# Altium schematic sheet 5V_Power_Stage.SchDoc (part 3 of 3)
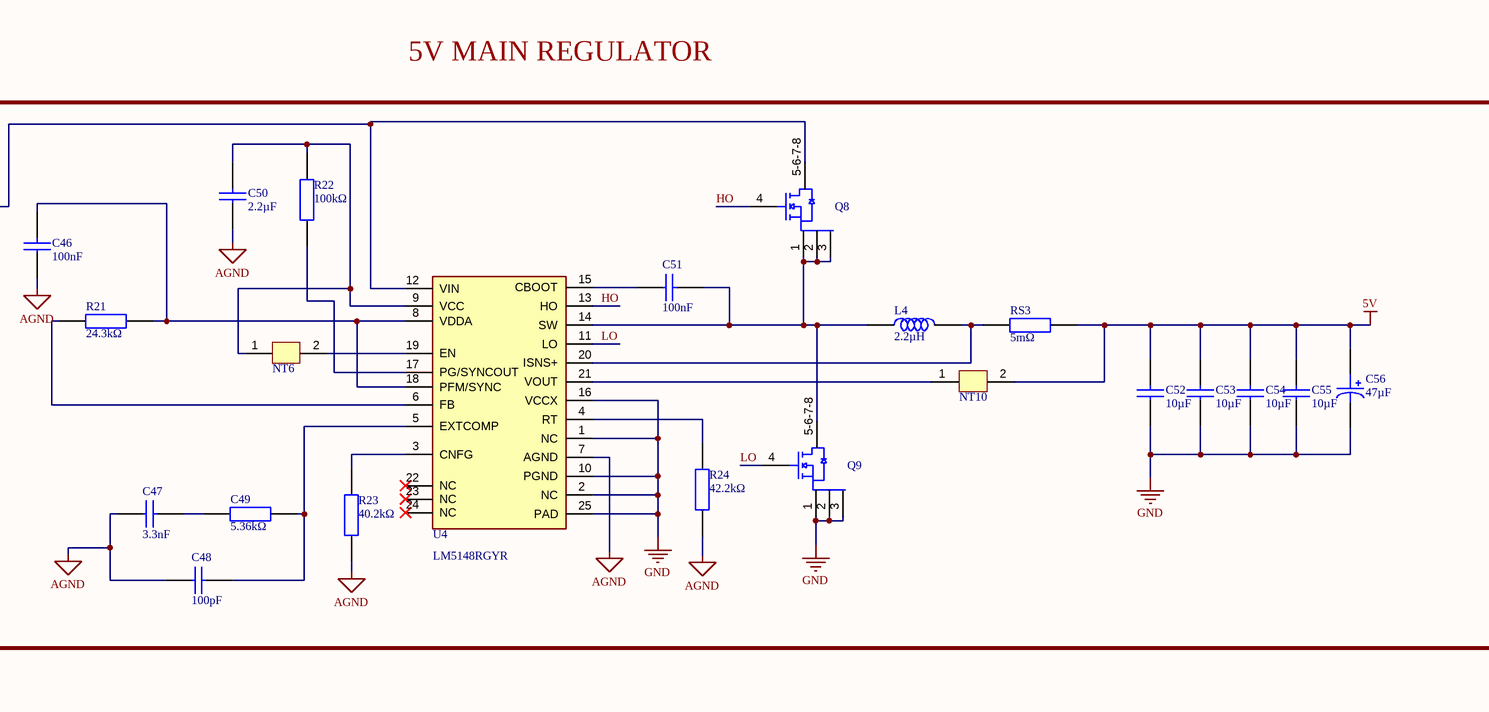
[diagram p3: 5V_Power_Stage.SchDoc, right]

## Library data of the parts (continued)
R21 = CRCW040224K3FKED: Fixed Resistor, Metal Glaze/Thick Film, 0.063W, 24300ohm, 50V, 1% +/-Tol, Surface Mount, 0402; Manufacturer: Vishay; Max Power Dissipation: 63mW; Temperature Coefficient: 100ppm/°C; Supplier: Farnell; Supplier Part Number: CRCW040224K3FKED; Manufacturer Part Number: CRCW040224K3FKED; RoHS: Compliant; Category: Chip SMD Resistors; Stock: 10000; Pricing: 10000=0,009 (EUR); Case/Package: 0402; Case Code (Imperial): 0402; China RoHS: Non-Compliant; Composition: Thick Film; Contact Plating: Tin; Country of Origin: Israel, Taiwan; Depth: 500µm; Export Control Classification Number (ECCN) Code: EAR99; Features: Automotive AEC-Q200; Height: 350µm; Harmonized Tariff Schedule (HTS) Code: 8533.21.00.30; Introduction Date: 2005-03-24; Lead Free: Lead Free; Length: 1mm; Lifecycle Status: Production; Max Operating Temperature: 155°C; Military Standard: Not; Min Operating Temperature: -55°C; Mounting Technology: Surface Mount; Pins: 2; Number of Terminals: 2; Number of Terminations: 2; Packaging: Cut Tape; Power Rating: 63mW; Radiation Hardening: No; Ratings: AEC-Q200; REACH SVHC: Yes; Schedule B: 8533210045; Termination: SMD/SMT; Tolerance: 1%; Voltage Rating: 50V; Voltage Rating (DC): 50V; Weight: 652.039032µg; Width: 500µm; Working Voltage: 50V; ComponentLink1URL: https://datasheet.octopart.com:443/CRCW040224K3FKED-Vishay-datasheet-175423584.pdf?src-supplier=IHS; ComponentLink1Description: https://datasheet.octopart.com:443/CRCW040224K3FKED-Vishay-datasheet-175423584.pdf?src-supplier=IHS; ComponentLink2URL: https://datasheet.octopart.com:443/CRCW040224K3FKED-Vishay-datasheet-66077789.pdf?src-supplier=Newark; ComponentLink2Description: https://datasheet.octopart.com:443/CRCW040224K3FKED-Vishay-datasheet-66077789.pdf?src-supplier=Newark; ComponentLink3URL: https://datasheet.octopart.com:443/CRCW040224K3FKED-Vishay-datasheet-11761042.pdf?src-supplier=Newark; ComponentLink3Description: https://datasheet.octopart.com:443/CRCW040224K3FKED-Vishay-datasheet-11761042.pdf?src-supplier=Newark; ComponentLink4URL: https://datasheet.octopart.com:443/CRCW040224K3FKED-Vishay-datasheet-11516975.pdf?src-supplier=Newark; ComponentLink4Description: https://datasheet.octopart.com:443/CRCW040224K3FKED-Vishay-datasheet-11516975.pdf?src-supplier=Newark; ComponentLink5URL: https://datasheet.octopart.com:443/CRCW040224K3FKED-Vishay-datasheet-41302739.pdf?src-supplier=Newark; ComponentLink5Description: https://datasheet.octopart.com:443/CRCW040224K3FKED-Vishay-datasheet-41302739.pdf?src-supplier=Newark; ComponentLink6URL: https://datasheet.octopart.com:443/CRCW040224K3FKED-Vishay-datasheet-33013972.pdf?src-supplier=Newark; ComponentLink6Description: https://datasheet.octopart.com:443/CRCW040224K3FKED-Vishay-datasheet-33013972.pdf?src-supplier=Newark; ComponentLink7URL: https://datasheet.octopart.com:443/CRCW040224K3FKED-Vishay-datasheet-21226360.pdf?src-supplier=Newark; ComponentLink7Description: https://datasheet.octopart.com:443/CRCW040224K3FKED-Vishay-datasheet-21226360.pdf?src-supplier=Newark; ComponentLink8URL: https://datasheet.octopart.com:443/CRCW040224K3FKED-Vishay-datasheet-62317933.pdf?src-supplier=Farnell; ComponentLink8Description: https://datasheet.octopart.com:443/CRCW040224K3FKED-Vishay-datasheet-62317933.pdf?src-supplier=Farnell; ComponentLink9URL: https://datasheet.octopart.com:443/CRCW040224K3FKED.-Vishay-datasheet-83961561.pdf?src-supplier=Farnell; ComponentLink9Description: https://datasheet.octopart.com:443/CRCW040224K3FKED.-Vishay-datasheet-83961561.pdf?src-supplier=Farnell; ComponentLink10URL: https://datasheet.octopart.com:443/CRCW040224K3FKED-Vishay-datasheet-14722531.pdf?src-supplier=element14+APAC; ComponentLink10Description: https://datasheet.octopart.com:443/CRCW040224K3FKED-Vishay-datasheet-14722531.pdf?src-supplier=element14+APAC; ComponentLink11URL: https://datasheet.octopart.com:443/CRCW040224K3FKED-Vishay-datasheet-5299586.pdf?src-supplier=element14+APAC; ComponentLink11Description: https://datasheet.octopart.com:443/CRCW040224K3FKED-Vishay-datasheet-5299586.pdf?src-supplier=element14+APAC; ComponentLink12URL: https://datasheet.octopart.com:443/CRCW040224K3FKED-Vishay-datasheet-10380026.pdf?src-supplier=element14+APAC; ComponentLink12Description: https://datasheet.octopart.com:443/CRCW040224K3FKED-Vishay-datasheet-10380026.pdf?src-supplier=element14+APAC; ComponentLink13URL: https://datasheet.octopart.com:443/CRCW040224K3FKED-Vishay-datasheet-62316122.pdf?src-supplier=Future+Electronics; ComponentLink13Description: https://datasheet.octopart.com:443/CRCW040224K3FKED-Vishay-datasheet-62316122.pdf?src-supplier=Future+Electronics; ComponentLink14URL: https://datasheet.octopart.com:443/CRCW040224K3FKED-Vishay-datasheet-12509741.pdf?src-supplier=Future+Electronics; ComponentLink14Description: https://datasheet.octopart.com:443/CRCW040224K3FKED-Vishay-datasheet-12509741.pdf?src-supplier=Future+Electronics; ComponentLink15URL: https://datasheet.octopart.com:443/CRCW040224K3FKED-Vishay-Dale-datasheet-47688880.pdf?src-supplier=RS+(Formerly+Allied+Electronics); ComponentLink15Description: https://datasheet.octopart.com:443/CRCW040224K3FKED-Vishay-Dale-datasheet-47688880.pdf?src-supplier=RS+(Formerly+Allied+Electronics); ComponentLink16URL: https://datasheet.octopart.com:443/CRCW040224K3FKED-Vishay-datasheet-12001583.pdf?src-supplier=RS+(Formerly+Allied+Electronics); ComponentLink16Description: https://datasheet.octopart.com:443/CRCW040224K3FKED-Vishay-datasheet-12001583.pdf?src-supplier=RS+(Formerly+Allied+Electronics); ComponentLink17URL: https://datasheet.octopart.com:443/CRCW040224K3FKED-Vishay-datasheet-5306405.pdf?src-supplier=RS+(Formerly+Allied+Electronics); ComponentLink17Description: https://datasheet.octopart.com:443/CRCW040224K3FKED-Vishay-datasheet-5306405.pdf?src-supplier=RS+(Formerly+Allied+Electronics); ComponentLink18URL: https://datasheet.octopart.com/D-CRCW-e3-Standard-Thick-Film-Chip-Resistors-Vishay-datasheet-family-64.pdf; ComponentLink18Description: https://datasheet.octopart.com/D-CRCW-e3-Standard-Thick-Film-Chip-Resistors-Vishay-datasheet-family-64.pdf; ComponentLink19URL: https://datasheet.octopart.com:443/CRCW040224K3FKED-Vishay-datasheet-11540273.pdf?src-supplier=Arrow+Electronics; ComponentLink19Description: https://datasheet.octopart.com:443/CRCW040224K3FKED-Vishay-datasheet-11540273.pdf?src-supplier=Arrow+Electronics; ComponentLink20URL: https://datasheet.octopart.com:443/CRCW040224K3FKED-Vishay-datasheet-8445837.pdf?src-supplier=element14; ComponentLink20Description: https://datasheet.octopart.com:443/CRCW040224K3FKED-Vishay-datasheet-8445837.pdf?src-supplier=element14; ComponentLink21URL: https://datasheet.octopart.com:443/CRCW040224K3FKED-Vishay-datasheet-5377255.pdf?src-supplier=Garrett; ComponentLink21Description: https://datasheet.octopart.com:443/CRCW040224K3FKED-Vishay-datasheet-5377255.pdf?src-supplier=Garrett; ComponentLink22URL: https://datasheet.octopart.com:443/CRCW040224K3FKED-Vishay-datasheet-148188.pdf?src-supplier=Garrett; ComponentLink22Description: https://datasheet.octopart.com:443/CRCW040224K3FKED-Vishay-datasheet-148188.pdf?src-supplier=Garrett; ComponentLink23URL: https://datasheet.octopart.com:443/CRCW040224K3FKED-Vishay-datasheet-42367.pdf?src-supplier=Garrett; ComponentLink23Description: https://datasheet.octopart.com:443/CRCW040224K3FKED-Vishay-datasheet-42367.pdf?src-supplier=Garrett; ComponentLink24URL: http://sigma.octopart.com:80/rohs_certificate/D-CRCW-e3-Standard-Thick-Film-Chip-Resistors-Vishay-family-102.pdf?src-supplier=Compliance+Statements; ComponentLink24Description: http://sigma.octopart.com:80/rohs_certificate/D-CRCW-e3-Standard-Thick-Film-Chip-Resistors-Vishay-family-102.pdf?src-supplier=Compliance+Statements
R22 = CRCW0603100KFKEA: Res Thick Film 0603 100K Ohm 1% 1/3W ±100ppm/°C Molded SMD SMD Paper T/R; Manufacturer: Vishay; Manufacturer Part Number: CRCW0603100KFKEAHP; Max Power Dissipation: 250mW; Power Rating: 330mW; Voltage Rating: 75V; Supplier: Farnell; Supplier Part Number: CRCW0603100KFKEAHP; RoHS: Compliant; Category: Chip SMD Resistors; Stock: 78590; Pricing: 10=0,0404, 100=0,0303, 500=0,0261, 1000=0,0239, 2500=0,0223, 5000=0,0219 (EUR); Case/Package: 0603; Case Code (Imperial): 0603; Case Code (Metric): 1608; China RoHS: Non-Compliant; Composition: Thick Film; Contact Plating: Tin; Country of Origin: Israel; Depth: 850µm; Export Control Classification Number (ECCN) Code: EAR99; Features: Automotive AEC-Q200; Height: 450µm; Harmonized Tariff Schedule (HTS) Code: 8533.21.00.30; Introduction Date: 2008-07-29; Lead Free: Lead Free; Length: 1.6mm; Lifecycle Status: Production; Max Operating Temperature: 155°C; Military Standard: Not; Min Operating Temperature: -55°C; Mounting Technology: Surface Mount; Pins: 2; Number of Terminals: 2; Number of Terminations: 2; Packaging: Cut Tape; Radiation Hardening: No; Ratings: AEC-Q200; REACH SVHC: Yes; Schedule B: 8533210045, 8533210045|8533210045|8533210045|8533210045|8533210045; Temperature Coefficient: 100ppm/°C; Termination: SMD/SMT; Tolerance: 1%; Voltage Rating (DC): 75V; Weight: 2.012816mg; Width: 850µm; Working Voltage: 75V; ComponentLink1URL: https://datasheet.octopart.com:443/CRCW0603100KFKEAHP-Vishay-datasheet-13148866.pdf?src-supplier=Future+Electronics; ComponentLink1Description: https://datasheet.octopart.com:443/CRCW0603100KFKEAHP-Vishay-datasheet-13148866.pdf?src-supplier=Future+Electronics; ComponentLink2URL: https://datasheet.octopart.com:443/CRCW0603100KFKEAHP-Vishay-datasheet-13131392.pdf?src-supplier=Future+Electronics; ComponentLink2Description: https://datasheet.octopart.com:443/CRCW0603100KFKEAHP-Vishay-datasheet-13131392.pdf?src-supplier=Future+Electronics; ComponentLink3URL: https://datasheet.octopart.com:443/CRCW0603100KFKEAHP-Vishay-datasheet-12593106.pdf?src-supplier=Future+Electronics; ComponentLink3Description: https://datasheet.octopart.com:443/CRCW0603100KFKEAHP-Vishay-datasheet-12593106.pdf?src-supplier=Future+Electronics; ComponentLink4URL: https://datasheet.octopart.com:443/CRCW0603100KFKEAHP-Vishay-datasheet-12531795.pdf?src-supplier=Future+Electronics; ComponentLink4Description: https://datasheet.octopart.com:443/CRCW0603100KFKEAHP-Vishay-datasheet-12531795.pdf?src-supplier=Future+Electronics; ComponentLink5URL: https://datasheet.octopart.com:443/CRCW0603100KFKEAHP-Vishay-datasheet-12518686.pdf?src-supplier=Future+Electronics; ComponentLink5Description: https://datasheet.octopart.com:443/CRCW0603100KFKEAHP-Vishay-datasheet-12518686.pdf?src-supplier=Future+Electronics; ComponentLink6URL: https://datasheet.octopart.com:443/CRCW0603100KFKEAHP-Vishay-datasheet-12509906.pdf?src-supplier=Future+Electronics; ComponentLink6Description: https://datasheet.octopart.com:443/CRCW0603100KFKEAHP-Vishay-datasheet-12509906.pdf?src-supplier=Future+Electronics; ComponentLink7URL: https://datasheet.octopart.com:443/CRCW0603100KFKEAHP-Vishay-datasheet-10669844.pdf?src-supplier=Future+Electronics; ComponentLink7Description: https://datasheet.octopart.com:443/CRCW0603100KFKEAHP-Vishay-datasheet-10669844.pdf?src-supplier=Future+Electronics; ComponentLink8URL: https://datasheet.octopart.com:443/CRCW0603100KFKEAHP-Vishay-datasheet-8703221.pdf?src-supplier=Future+Electronics; ComponentLink8Description: https://datasheet.octopart.com:443/CRCW0603100KFKEAHP-Vishay-datasheet-8703221.pdf?src-supplier=Future+Electronics; ComponentLink9URL: https://datasheet.octopart.com:443/CRCW0603100KFKEAHP-Vishay-datasheet-62316122.pdf?src-supplier=Future+Electronics; ComponentLink9Description: https://datasheet.octopart.com:443/CRCW0603100KFKEAHP-Vishay-datasheet-62316122.pdf?src-supplier=Future+Electronics; ComponentLink10URL: https://datasheet.octopart.com:443/CRCW0603100KFKEAHP-Vishay-datasheet-12544674.pdf?src-supplier=_legacy+Avnet; ComponentLink10Description: https://datasheet.octopart.com:443/CRCW0603100KFKEAHP-Vishay-datasheet-12544674.pdf?src-supplier=_legacy+Avnet; ComponentLink11URL: https://datasheet.octopart.com:443/CRCW0603100KFKEAHP-Vishay-datasheet-87136057.pdf?src-supplier=Newark; ComponentLink11Description: https://datasheet.octopart.com:443/CRCW0603100KFKEAHP-Vishay-datasheet-87136057.pdf?src-supplier=Newark; ComponentLink12URL: https://datasheet.octopart.com:443/CRCW0603100KFKEAHP-Vishay-datasheet-66581887.pdf?src-supplier=Newark; ComponentLink12Description: https://datasheet.octopart.com:443/CRCW0603100KFKEAHP-Vishay-datasheet-66581887.pdf?src-supplier=Newark; ComponentLink13URL: https://datasheet.octopart.com:443/CRCW0603100KFKEAHP-Vishay-datasheet-37143532.pdf?src-supplier=Newark; ComponentLink13Description: https://datasheet.octopart.com:443/CRCW0603100KFKEAHP-Vishay-datasheet-37143532.pdf?src-supplier=Newark; ComponentLink14URL: https://datasheet.octopart.com:443/CRCW0603100KFKEAHP-Vishay-datasheet-8359436.pdf?src-supplier=Newark; ComponentLink14Description: https://datasheet.octopart.com:443/CRCW0603100KFKEAHP-Vishay-datasheet-8359436.pdf?src-supplier=Newark; ComponentLink15URL: https://datasheet.octopart.com:443/CRCW0603100KFKEAHP-Vishay-datasheet-112276998.pdf?src-supplier=Newark; ComponentLink15Description: https://datasheet.octopart.com:443/CRCW0603100KFKEAHP-Vishay-datasheet-112276998.pdf?src-supplier=Newark; ComponentLink16URL: https://datasheet.octopart.com:443/CRCW0603100KFKEAHP-Vishay-datasheet-62317933.pdf?src-supplier=element14+APAC; ComponentLink16Description: https://datasheet.octopart.com:443/CRCW0603100KFKEAHP-Vishay-datasheet-62317933.pdf?src-supplier=element14+APAC; ComponentLink17URL: https://datasheet.octopart.com/CRCW0603100KFKEAHP-Vishay-datasheet-83567917.pdf; ComponentLink17Description: https://datasheet.octopart.com/CRCW0603100KFKEAHP-Vishay-datasheet-83567917.pdf; ComponentLink18URL: https://datasheet.octopart.com/D-CRCW-e3-Standard-Thick-Film-Chip-Resistors-Vishay-datasheet-family-64.pdf; ComponentLink18Description: https://datasheet.octopart.com/D-CRCW-e3-Standard-Thick-Film-Chip-Resistors-Vishay-datasheet-family-64.pdf; ComponentLink19URL: https://datasheet.octopart.com:443/CRCW0603100KFKEAHP-Vishay-Dale-datasheet-47688881.pdf?src-supplier=RS+(Formerly+Allied+Electronics); ComponentLink19Description: https://datasheet.octopart.com:443/CRCW0603100KFKEAHP-Vishay-Dale-datasheet-47688881.pdf?src-supplier=RS+(Formerly+Allied+Electronics); ComponentLink20URL: http://sigma.octopart.com:80/rohs_certificate/D-CRCW-e3-Standard-Thick-Film-Chip-Resistors-Vishay-family-102.pdf?src-supplier=Compliance+Statements; ComponentLink20Description: http://sigma.octopart.com:80/rohs_certificate/D-CRCW-e3-Standard-Thick-Film-Chip-Resistors-Vishay-family-102.pdf?src-supplier=Compliance+Statements
R23 = RC0603FR-0740K2L: Res Thick Film 0603 40.2K Ohm 1% 0.1W(1/10W) ±100ppm/C Pad SMD T/R; Manufacturer: Yageo Group; Power Rating: 100mW; Temperature Coefficient: 100ppm/°C; Voltage Rating: 75V; Voltage Rating (DC): 50V; Supplier: Farnell; Supplier Part Number: RC0603FR-0740K2L; Manufacturer Part Number: RC0603FR-0740K2L; RoHS: Compliant; Category: Chip SMD Resistors; Stock: 12210; Pricing: 10=0,0071, 100=0,0061, 500=0,006, 1000=0,0058, 2500=0,0045 (EUR); Case/Package: 0603; Case Code (Imperial): 0603; China RoHS: Non-Compliant; Composition: Thick Film; Country of Origin: Mainland China, Taiwan; Depth: 800µm; Export Control Classification Number (ECCN) Code: EAR99; Height: 450µm; Harmonized Tariff Schedule (HTS) Code: 8533.21.00.30; Introduction Date: 2004-09-22; Lead Free: Lead Free; Length: 1.6mm; Lifecycle Status: Production; Max Operating Temperature: 155°C; Military Standard: Not; Min Operating Temperature: -55°C; Mounting Technology: Surface Mount; Number of Terminals: 2; Number of Terminations: 2; Packaging: Cut Tape (CT); REACH SVHC: Yes; Schedule B: 8533210045, 8533210045|8533210045, 8533210045|8533210045|8533210045, 8533210045|8533210045|8533210045|8533210045; Termination: SMD/SMT; Tolerance: 1%; Width: 800µm; Working Voltage: 75V; ComponentLink1URL: https://datasheet.octopart.com:443/RC0603FR-0740K2L-Yageo-datasheet-175887523.pdf?src-supplier=IHS; ComponentLink1Description: https://datasheet.octopart.com:443/RC0603FR-0740K2L-Yageo-datasheet-175887523.pdf?src-supplier=IHS; ComponentLink2URL: https://datasheet.octopart.com:443/RC0603FR-0740K2L-Yageo-datasheet-8328172.pdf?src-supplier=Upverter; ComponentLink2Description: https://datasheet.octopart.com:443/RC0603FR-0740K2L-Yageo-datasheet-8328172.pdf?src-supplier=Upverter; ComponentLink3URL: https://datasheet.octopart.com:443/RC0603FR-0740K2L-Yageo-datasheet-141265859.pdf?src-supplier=Upverter; ComponentLink3Description: https://datasheet.octopart.com:443/RC0603FR-0740K2L-Yageo-datasheet-141265859.pdf?src-supplier=Upverter; ComponentLink4URL: https://datasheet.octopart.com:443/RC0603FR-0740K2L-Yageo-datasheet-103092701.pdf?src-supplier=Upverter; ComponentLink4Description: https://datasheet.octopart.com:443/RC0603FR-0740K2L-Yageo-datasheet-103092701.pdf?src-supplier=Upverter; ComponentLink5URL: https://sigma.octopart.com:443/138820526/technical_drawing/Yageo-RC0603FR-0740K2L.pdf?src-supplier=Upverter; ComponentLink5Description: https://sigma.octopart.com:443/138820526/technical_drawing/Yageo-RC0603FR-0740K2L.pdf?src-supplier=Upverter; ComponentLink6URL: https://datasheet.octopart.com:443/RC0603FR-0740K2L-Yageo-datasheet-79472498.pdf?src-supplier=Upverter; ComponentLink6Description: https://datasheet.octopart.com:443/RC0603FR-0740K2L-Yageo-datasheet-79472498.pdf?src-supplier=Upverter; ComponentLink7URL: https://datasheet.octopart.com:443/RC0603FR-0740K2L-Yageo-Group-datasheet-190305687.pdf?src-supplier=Future+Electronics; ComponentLink7Description: https://datasheet.octopart.com:443/RC0603FR-0740K2L-Yageo-Group-datasheet-190305687.pdf?src-supplier=Future+Electronics; ComponentLink8URL: https://datasheet.octopart.com:443/RC0603FR-0740K2L-Yageo-datasheet-164759695.pdf?src-supplier=Future+Electronics; ComponentLink8Description: https://datasheet.octopart.com:443/RC0603FR-0740K2L-Yageo-datasheet-164759695.pdf?src-supplier=Future+Electronics; ComponentLink9URL: https://datasheet.octopart.com:443/RC0603FR-0740K2L-Yageo-datasheet-137700087.pdf?src-supplier=Future+Electronics; ComponentLink9Description: https://datasheet.octopart.com:443/RC0603FR-0740K2L-Yageo-datasheet-137700087.pdf?src-supplier=Future+Electronics; ComponentLink10URL: https://datasheet.octopart.com:443/RC0603FR-0740K2L-Yageo-datasheet-15599030.pdf?src-supplier=Future+Electronics; ComponentLink10Description: https://datasheet.octopart.com:443/RC0603FR-0740K2L-Yageo-datasheet-15599030.pdf?src-supplier=Future+Electronics; ComponentLink11URL: https://datasheet.octopart.com:443/RC0603FR-0740K2L-Yageo-datasheet-12596169.pdf?src-supplier=Future+Electronics; ComponentLink11Description: https://datasheet.octopart.com:443/RC0603FR-0740K2L-Yageo-datasheet-12596169.pdf?src-supplier=Future+Electronics; ComponentLink12URL: https://datasheet.octopart.com:443/RC0603FR-0740K2L-Yageo-datasheet-503470.pdf?src-supplier=Future+Electronics; ComponentLink12Description: https://datasheet.octopart.com:443/RC0603FR-0740K2L-Yageo-datasheet-503470.pdf?src-supplier=Future+Electronics; ComponentLink13URL: https://datasheet.octopart.com/RC0603FR-0740K2L-Yageo-datasheet-73766026.pdf; ComponentLink13Description: https://datasheet.octopart.com/RC0603FR-0740K2L-Yageo-datasheet-73766026.pdf; ComponentLink14URL: https://datasheet.octopart.com:443/RC0603FR-0740K2L-Yageo-datasheet-118562.pdf?src-supplier=DigiKey; ComponentLink14Description: https://datasheet.octopart.com:443/RC0603FR-0740K2L-Yageo-datasheet-118562.pdf?src-supplier=DigiKey; ComponentLink15URL: https://datasheet.octopart.com:443/RC0603FR-0740K2L-Yageo-datasheet-62067350.pdf?src-supplier=Newark; ComponentLink15Description: https://datasheet.octopart.com:443/RC0603FR-0740K2L-Yageo-datasheet-62067350.pdf?src-supplier=Newark; ComponentLink16URL: http://sigma.octopart.com:80/conflict_mineral_statement/Yageo-company-3.pdf?src-supplier=Compliance+Statements; ComponentLink16Description: http://sigma.octopart.com:80/conflict_mineral_statement/Yageo-company-3.pdf?src-supplier=Compliance+Statements; ComponentLink17URL: http://sigma.octopart.com:80/rohs_statement/Yageo-company-2.pdf?src-supplier=Compliance+Statements; ComponentLink17Description: http://sigma.octopart.com:80/rohs_statement/Yageo-company-2.pdf?src-supplier=Compliance+Statements
R24 = CRCW060342K2FKEA: Res Thick Film 0603 42.2K Ohm 1% 1/10W ±100ppm/°C Molded SMD Paper T/R; Manufacturer: Vishay; Max Power Dissipation: 100mW; Voltage Rating: 75V; Supplier: Farnell; Supplier Part Number: CRCW060342K2FKEA; Manufacturer Part Number: CRCW060342K2FKEA; RoHS: Compliant; Category: Chip SMD Resistors; Stock: 25000; Pricing: 5000=0,0097 (EUR); Case/Package: 0603; Case Code (Imperial): 0603; China RoHS: Non-Compliant; Composition: Thick Film; Contact Plating: Tin; Country of Origin: Israel, Taiwan; Depth: 850µm; Export Control Classification Number (ECCN) Code: EAR99; Features: Automotive AEC-Q200; Height: 450µm; Harmonized Tariff Schedule (HTS) Code: 8533.21.00.30; Introduction Date: 2005-02-16; Lead Free: Lead Free; Length: 1.55mm; Lifecycle Status: Production; Max Operating Temperature: 155°C; Military Standard: Not; Min Operating Temperature: -55°C; Mounting Technology: Surface Mount; Pins: 2; Number of Terminals: 2; Number of Terminations: 2; Packaging: Cut Tape; Power Rating: 100mW; Radiation Hardening: No; Ratings: AEC-Q200; REACH SVHC: Yes; Schedule B: 8533210045, 8533210045|8533210045|8533210045|8533210045|8533210045|8533210045|8533210045|8533210045|8533210045|8533210045|8533210045|8533210045|8533210045|8533210045|8533210045|8533210045|8533210045|8533210045|8533210045|8533210045|8533210045|8533210045|8533210045|85; Temperature Coefficient: 100ppm/°C; Termination: SMD/SMT; Tolerance: 1%; Voltage Rating (DC): 75V; Weight: 2.012816mg; Width: 850µm; Working Voltage: 75V; ComponentLink1URL: https://datasheet.octopart.com:443/CRCW060342K2FKEA-Vishay-datasheet-175423584.pdf?src-supplier=IHS; ComponentLink1Description: https://datasheet.octopart.com:443/CRCW060342K2FKEA-Vishay-datasheet-175423584.pdf?src-supplier=IHS; ComponentLink2URL: https://datasheet.octopart.com:443/CRCW060342K2FKEA-Vishay-datasheet-62316122.pdf?src-supplier=Future+Electronics; ComponentLink2Description: https://datasheet.octopart.com:443/CRCW060342K2FKEA-Vishay-datasheet-62316122.pdf?src-supplier=Future+Electronics; ComponentLink3URL: https://datasheet.octopart.com:443/CRCW060342K2FKEA-Vishay-datasheet-12509741.pdf?src-supplier=Future+Electronics; ComponentLink3Description: https://datasheet.octopart.com:443/CRCW060342K2FKEA-Vishay-datasheet-12509741.pdf?src-supplier=Future+Electronics; ComponentLink4URL: https://datasheet.octopart.com:443/CRCW060342K2FKEA-Vishay-datasheet-190005712.pdf?src-supplier=TME; ComponentLink4Description: https://datasheet.octopart.com:443/CRCW060342K2FKEA-Vishay-datasheet-190005712.pdf?src-supplier=TME; ComponentLink5URL: https://datasheet.octopart.com:443/CRCW060342K2FKEA-Vishay-datasheet-83961561.pdf?src-supplier=Newark; ComponentLink5Description: https://datasheet.octopart.com:443/CRCW060342K2FKEA-Vishay-datasheet-83961561.pdf?src-supplier=Newark; ComponentLink6URL: https://datasheet.octopart.com:443/CRCW060342K2FKEA-Vishay-datasheet-11516975.pdf?src-supplier=Newark; ComponentLink6Description: https://datasheet.octopart.com:443/CRCW060342K2FKEA-Vishay-datasheet-11516975.pdf?src-supplier=Newark; ComponentLink7URL: https://datasheet.octopart.com:443/CRCW060342K2FKEA-Vishay-datasheet-33013972.pdf?src-supplier=Newark; ComponentLink7Description: https://datasheet.octopart.com:443/CRCW060342K2FKEA-Vishay-datasheet-33013972.pdf?src-supplier=Newark; ComponentLink8URL: https://datasheet.octopart.com:443/CRCW060342K2FKEA-Vishay-datasheet-21268114.pdf?src-supplier=Newark; ComponentLink8Description: https://datasheet.octopart.com:443/CRCW060342K2FKEA-Vishay-datasheet-21268114.pdf?src-supplier=Newark; ComponentLink9URL: https://datasheet.octopart.com:443/CRCW060342K2FKEA-Vishay-datasheet-21226360.pdf?src-supplier=Newark; ComponentLink9Description: https://datasheet.octopart.com:443/CRCW060342K2FKEA-Vishay-datasheet-21226360.pdf?src-supplier=Newark; ComponentLink10URL: https://datasheet.octopart.com:443/CRCW060342K2FKEA-Vishay-datasheet-62317939.pdf?src-supplier=element14+APAC; ComponentLink10Description: https://datasheet.octopart.com:443/CRCW060342K2FKEA-Vishay-datasheet-62317939.pdf?src-supplier=element14+APAC; ComponentLink11URL: https://datasheet.octopart.com:443/CRCW060342K2FKEA-Vishay-datasheet-10882403.pdf?src-supplier=element14+APAC; ComponentLink11Description: https://datasheet.octopart.com:443/CRCW060342K2FKEA-Vishay-datasheet-10882403.pdf?src-supplier=element14+APAC; ComponentLink12URL: https://datasheet.octopart.com:443/CRCW060342K2FKEA.-Vishay-datasheet-78776211.pdf?src-supplier=element14+APAC; ComponentLink12Description: https://datasheet.octopart.com:443/CRCW060342K2FKEA.-Vishay-datasheet-78776211.pdf?src-supplier=element14+APAC; ComponentLink13URL: https://datasheet.octopart.com:443/CRCW060342K2FKEA-Vishay-datasheet-66077789.pdf?src-supplier=element14+APAC; ComponentLink13Description: https://datasheet.octopart.com:443/CRCW060342K2FKEA-Vishay-datasheet-66077789.pdf?src-supplier=element14+APAC; ComponentLink14URL: https://datasheet.octopart.com:443/CRCW060342K2FKEA-Vishay-datasheet-14722531.pdf?src-supplier=element14+APAC; ComponentLink14Description: https://datasheet.octopart.com:443/CRCW060342K2FKEA-Vishay-datasheet-14722531.pdf?src-supplier=element14+APAC; ComponentLink15URL: https://datasheet.octopart.com:443/CRCW060342K2FKEA-Vishay-Dale-datasheet-47688880.pdf?src-supplier=RS+(Formerly+Allied+Electronics); ComponentLink15Description: https://datasheet.octopart.com:443/CRCW060342K2FKEA-Vishay-Dale-datasheet-47688880.pdf?src-supplier=RS+(Formerly+Allied+Electronics); ComponentLink16URL: https://datasheet.octopart.com:443/CRCW060342K2FKEA-Vishay-datasheet-12001583.pdf?src-supplier=RS+(Formerly+Allied+Electronics); ComponentLink16Description: https://datasheet.octopart.com:443/CRCW060342K2FKEA-Vishay-datasheet-12001583.pdf?src-supplier=RS+(Formerly+Allied+Electronics); ComponentLink17URL: https://datasheet.octopart.com:443/CRCW060342K2FKEA-Vishay-datasheet-5306405.pdf?src-supplier=RS+(Formerly+Allied+Electronics); ComponentLink17Description: https://datasheet.octopart.com:443/CRCW060342K2FKEA-Vishay-datasheet-5306405.pdf?src-supplier=RS+(Formerly+Allied+Electronics); ComponentLink18URL: https://datasheet.octopart.com/D-CRCW-e3-Standard-Thick-Film-Chip-Resistors-Vishay-datasheet-family-64.pdf; ComponentLink18Description: https://datasheet.octopart.com/D-CRCW-e3-Standard-Thick-Film-Chip-Resistors-Vishay-datasheet-family-64.pdf; ComponentLink19URL: https://datasheet.octopart.com:443/CRCW060342K2FKEA-Vishay-datasheet-8445837.pdf?src-supplier=element14; ComponentLink19Description: https://datasheet.octopart.com:443/CRCW060342K2FKEA-Vishay-datasheet-8445837.pdf?src-supplier=element14; ComponentLink20URL: https://datasheet.octopart.com:443/CRCW060342K2FKEA-Vishay-datasheet-5377433.pdf?src-supplier=Garrett; ComponentLink20Description: https://datasheet.octopart.com:443/CRCW060342K2FKEA-Vishay-datasheet-5377433.pdf?src-supplier=Garrett; ComponentLink21URL: https://datasheet.octopart.com:443/CRCW060342K2FKEA-Vishay-datasheet-148188.pdf?src-supplier=Garrett; ComponentLink21Description: https://datasheet.octopart.com:443/CRCW060342K2FKEA-Vishay-datasheet-148188.pdf?src-supplier=Garrett; ComponentLink22URL: https://datasheet.octopart.com:443/CRCW060342K2FKEA-Vishay-datasheet-30224.pdf?src-supplier=Garrett; ComponentLink22Description: https://datasheet.octopart.com:443/CRCW060342K2FKEA-Vishay-datasheet-30224.pdf?src-supplier=Garrett; ComponentLink23URL: https://datasheet.octopart.com:443/CRCW060342K2FKEA-Vishay-datasheet-5300368.pdf?src-supplier=Farnell; ComponentLink23Description: https://datasheet.octopart.com:443/CRCW060342K2FKEA-Vishay-datasheet-5300368.pdf?src-supplier=Farnell; ComponentLink24URL: http://sigma.octopart.com:80/rohs_certificate/D-CRCW-e3-Standard-Thick-Film-Chip-Resistors-Vishay-family-102.pdf?src-supplier=Compliance+Statements; ComponentLink24Description: http://sigma.octopart.com:80/rohs_certificate/D-CRCW-e3-Standard-Thick-Film-Chip-Resistors-Vishay-family-102.pdf?src-supplier=Compliance+Statements
RS3 = CSNL2010FT5L00: Res Metal Foil 2010 0.005 Ohm 1% 1.5W ±50ppm/°C Molded SMD SMD Plastic T/R; Manufacturer: Stackpole Electronics; Supplier: Arrow Electronics; Supplier Part Number: CSNL2010FT5L00; Manufacturer Part Number: CSNL2010FT5L00; RoHS: Compliant; Category: Chip SMD Resistors; Stock: 61; Pricing: 1=0,302, 10=0,2557, 25=0,1568 (USD); Case/Package: 2010; Case Code (Imperial): 2010; Case Code (Metric): 5025; Composition: Metal Strip; Contact Plating: Tin; Features: Moisture Resistant; Height: 650µm; Lead Free: Lead Free; Length: 5.08mm; Lifecycle Status: Production; Max Operating Temperature: 170°C; Max Power Dissipation: 1.5W; Min Operating Temperature: -55°C; Mounting Technology: Surface Mount; Number of Terminals: 2; Number of Terminations: 2; Packaging: Cut Tape (CT); Power Rating: 1.5W; Radiation Hardening: No; REACH SVHC: Yes; Schedule B: 8533210045, 8533210045|8533210045, 8533210045|8533210045|8533210045, 8533210045|8533210045|8533210045|8533210045; Temperature Coefficient: 50ppm/°C; Tolerance: 1%; Width: 2.54mm; ComponentLink1URL: https://datasheet.octopart.com:443/CSNL2010FT5L00-Stackpole-Electronics-datasheet-141193808.pdf?src-supplier=Master+Electronics; ComponentLink1Description: https://datasheet.octopart.com:443/CSNL2010FT5L00-Stackpole-Electronics-datasheet-141193808.pdf?src-supplier=Master+Electronics; ComponentLink2URL: https://datasheet.octopart.com:443/CSNL2010FT5L00-Stackpole-Electronics-datasheet-182147900.pdf?src-supplier=IHS; ComponentLink2Description: https://datasheet.octopart.com:443/CSNL2010FT5L00-Stackpole-Electronics-datasheet-182147900.pdf?src-supplier=IHS; ComponentLink3URL: https://datasheet.octopart.com:443/CSNL2010FT5L00-Stackpole-Electronics-datasheet-141158293.pdf?src-supplier=Stackpole+Electronics; ComponentLink3Description: https://datasheet.octopart.com:443/CSNL2010FT5L00-Stackpole-Electronics-datasheet-141158293.pdf?src-supplier=Stackpole+Electronics; ComponentLink4URL: https://datasheet.octopart.com:443/CSNL2010FT5L00-Stackpole-Electronics-datasheet-10788535.pdf?src-supplier=Stackpole+Electronics; ComponentLink4Description: https://datasheet.octopart.com:443/CSNL2010FT5L00-Stackpole-Electronics-datasheet-10788535.pdf?src-supplier=Stackpole+Electronics; ComponentLink5URL: https://datasheet.octopart.com:443/CSNL2010FT5L00-Stackpole-Electronics-datasheet-62316127.pdf?src-supplier=Future+Electronics; ComponentLink5Description: https://datasheet.octopart.com:443/CSNL2010FT5L00-Stackpole-Electronics-datasheet-62316127.pdf?src-supplier=Future+Electronics; ComponentLink6URL: http://sigma.octopart.com:80/15940492/materials_sheet/Stackpole-Electronics-CSNL2010FT5L00.pdf?src-supplier=Compliance+Statements; ComponentLink6Description: http://sigma.octopart.com:80/15940492/materials_sheet/Stackpole-Electronics-CSNL2010FT5L00.pdf?src-supplier=Compliance+Statements; ComponentLink7URL: http://sigma.octopart.com:80/141158211/reach_statement/Stackpole-Electronics-CSNL2010FT5L00.pdf?src-supplier=Compliance+Statements; ComponentLink7Description: http://sigma.octopart.com:80/141158211/reach_statement/Stackpole-Electronics-CSNL2010FT5L00.pdf?src-supplier=Compliance+Statements; ComponentLink8URL: http://sigma.octopart.com:80/141158212/rohs_statement/Stackpole-Electronics-CSNL2010FT5L00.pdf?src-supplier=Compliance+Statements; ComponentLink8Description: http://sigma.octopart.com:80/141158212/rohs_statement/Stackpole-Electronics-CSNL2010FT5L00.pdf?src-supplier=Compliance+Statements
U4 = LM5148RGYR: 3.5-V to 80-V, current mode synchronous buck controller 24-VQFN -40 to 125; Manufacturer: Texas Instruments; Manufacturer Lifecycle Status: ACTIVE; Max Duty Cycle: 100%; Max Junction Temperature (Tj): 150°C; Max Supply Voltage: 80V; Min Supply Voltage: 3.5V; Number of Outputs: 1; Output Current: 20A; Supplier: Mouser; Supplier Part Number: 595-LM5148RGYR; Manufacturer Part Number: LM5148RGYR; RoHS: Compliant; Category: Voltage Regulators - Switching; Stock: 7731; Pricing: 1=2,05, 10=1,52, 50=1,38, 100=1,24, 1000=1,09, 10000=1,04 (USD); Case/Package: VQFN; Height: 1mm; Length: 5.5mm; Lifecycle Status: Production; Max Operating Temperature: 125°C; Min Operating Temperature: -40°C; Pins: 24; Thickness: 900µm; Topology: Buck; Width: 3.5mm; ComponentLink1URL: https://octopart.com:443/opatz8j6/c1?t=k5HYukbKpAPwbY-87GrEenTJk9MNAaYavK5OGnMfo5xR5AheUhsW0QrQ__jAagB2G7ifgkNZ9LlbGgmastwPsycv2IuxuliPxyuY95BNxN18afFzmyufWtZk0CSFzD_-00jq0-d0ldnWKwAiLQLikyht430IWlpGJLcfLlqJhvIu1GeJ_Tp_edc5pT3Sfet7s6Qf0iT4HQFeU5M_DhcO5-saEgJOFs4UfDZINtzmQIr06dvlKuFFhuh85D68_nFjCJgw90UJc70QHIKhgZhI_J4VFggVK_UUHlgpmBeKA7mmUM_A-zyQhfTdxUopEqudTy3eaxTTW-bK-OyrTHR1mRCgULgnxMTN1KsRo7XVP9NWwtZL5E64bIOPOiG-shDPM5s02dQ&src-supplier=Texas+Instruments; ComponentLink1Description: https://octopart.com:443/opatz8j6/c1?t=k5HYukbKpAPwbY-87GrEenTJk9MNAaYavK5OGnMfo5xR5AheUhsW0QrQ__jAagB2G7ifgkNZ9LlbGgmastwPsycv2IuxuliPxyuY95BNxN18afFzmyufWtZk0CSFzD_-00jq0-d0ldnWKwAiLQLikyht430IWlpGJLcfLlqJhvIu1GeJ_Tp_edc5pT3Sfet7s6Qf0iT4HQFeU5M_DhcO5-saEgJOFs4UfDZINtzmQIr06dvlKuFFhuh85D68_nFjCJgw90UJc70QHIKhgZhI_J4VFggVK_UUHlgpmBeKA7mmUM_A-zyQhfTdxUopEqudTy3eaxTTW-bK-OyrTHR1mRCgULgnxMTN1KsRo7XVP9NWwtZL5E64bIOPOiG-shDPM5s02dQ&src-supplier=Texas+Instruments; ComponentLink2URL: https://datasheet.octopart.com:443/LM5148RGYR-Texas-Instruments-datasheet-170602647.pdf?src-supplier=Upverter; ComponentLink2Description: https://datasheet.octopart.com:443/LM5148RGYR-Texas-Instruments-datasheet-170602647.pdf?src-supplier=Upverter; ComponentLink3URL: http://sigma.octopart.com:80/reach_statement/Texas-Instruments-company-64.pdf?src-supplier=Compliance+Statements; ComponentLink3Description: http://sigma.octopart.com:80/reach_statement/Texas-Instruments-company-64.pdf?src-supplier=Compliance+Statements; ComponentLink4URL: http://sigma.octopart.com:80/conflict_mineral_statement/Texas-Instruments-company-63.pdf?src-supplier=Compliance+Statements; ComponentLink4Description: http://sigma.octopart.com:80/conflict_mineral_statement/Texas-Instruments-company-63.pdf?src-supplier=Compliance+Statements